# EAGLE schematic MDE-DR-4 (EAGLE 6.4)

## Sheet 1 of 4
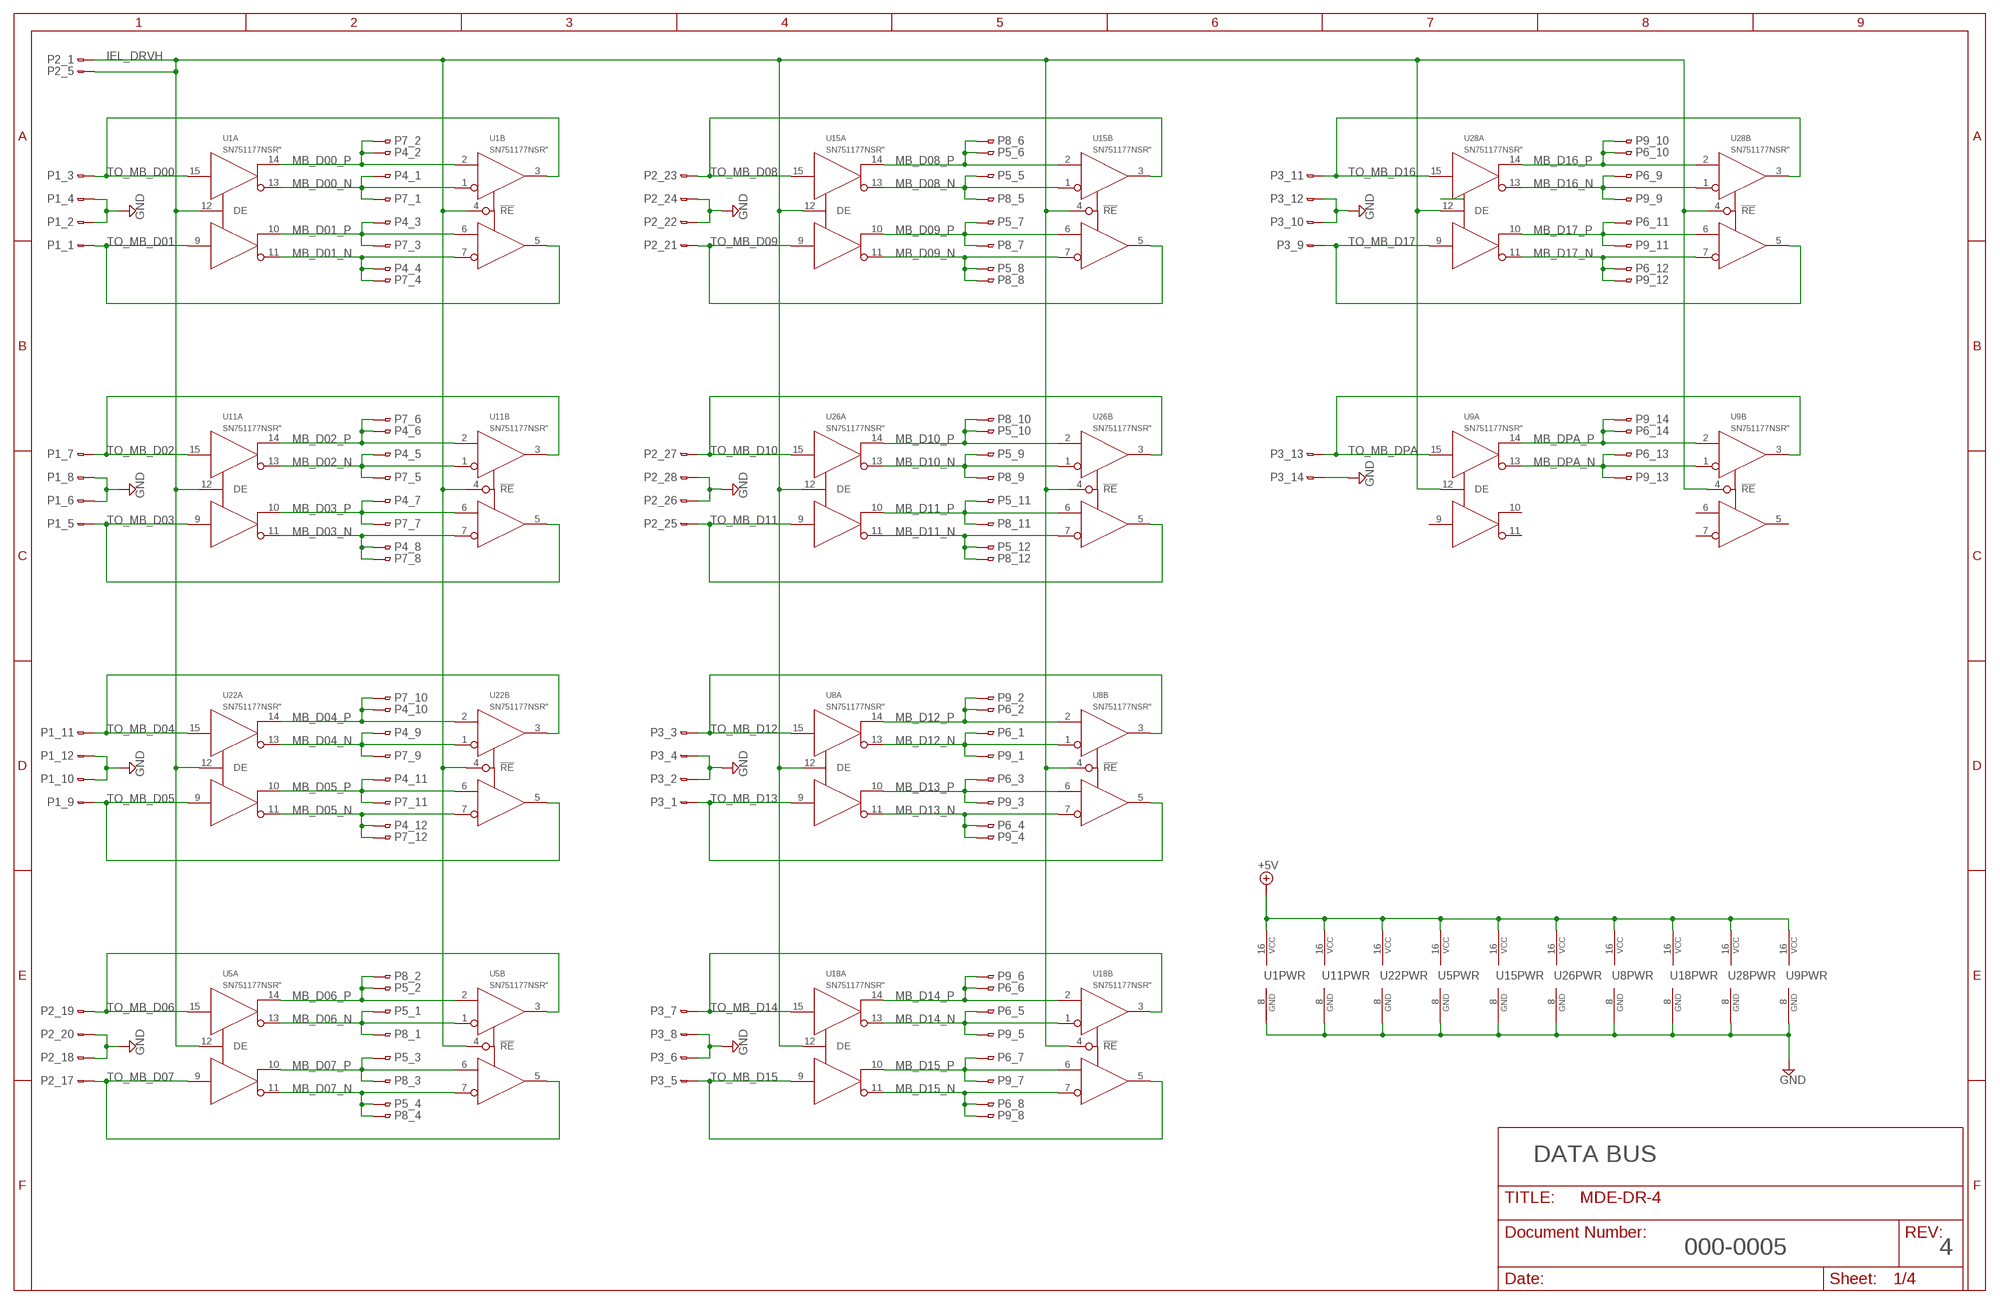
[diagram p0: schematic, sheet 1]

### Parts
P1  CON50L  [CON50L]
P2  CON50L  [CON50L]
P3  CON50L  [CON50L]
P4  CON40L  [CON40L]
P5  CON40L  [CON40L]
P6  CON40L  [CON40L]
P7  CON40L  [CON40L]
P8  CON40L  [CON40L]
P9  CON40L  [CON40L]
U1  SN751177NSR"  [SO16NS]
U5  SN751177NSR"  [SO16NS]
U8  SN751177NSR"  [SO16NS]
U9  SN751177NSR"  [SO16NS]
U11  SN751177NSR"  [SO16NS]
U15  SN751177NSR"  [SO16NS]
U18  SN751177NSR"  [SO16NS]
U22  SN751177NSR"  [SO16NS]
U26  SN751177NSR"  [SO16NS]
U28  SN751177NSR"  [SO16NS]

### Nets
+5V: U1.16(PWR:VCC) U5.16(PWR:VCC) U8.16(PWR:VCC) U9.16(PWR:VCC) U11.16(PWR:VCC) U15.16(PWR:VCC) U18.16(PWR:VCC) U22.16(PWR:VCC) U26.16(PWR:VCC) U28.16(PWR:VCC) ; also sheet 2,3,4
GND: P1.2 P1.4 P1.6 P1.8 P1.10 P1.12 P2.18 P2.20 P2.22 P2.24 P2.26 P2.28 P3.2 P3.4 P3.6 P3.8 P3.10 P3.12 P3.14 U1.8(PWR:GND) U5.8(PWR:GND) U8.8(PWR:GND) U9.8(PWR:GND) U11.8(PWR:GND) U15.8(PWR:GND) U18.8(PWR:GND) U22.8(PWR:GND) U26.8(PWR:GND) U28.8(PWR:GND) ; also sheet 2,3,4
IEL_DRVH: P2.1 P2.5 U1.4(B:!RE) U1.12(A:DE) U5.4(B:!RE) U5.12(A:DE) U8.4(B:!RE) U8.12(A:DE) U9.4(B:!RE) U9.12(A:DE) U11.4(B:!RE) U11.12(A:DE) U15.4(B:!RE) U15.12(A:DE) U18.4(B:!RE) U18.12(A:DE) U22.4(B:!RE) U22.12(A:DE) U26.4(B:!RE) U26.12(A:DE) U28.4(B:!RE) U28.12(A:DE)
MB_D00_N: P4.1 P7.1 U1.1(B:!1B) U1.13(A:!1Z)
MB_D00_P: P4.2 P7.2 U1.2(B:1A) U1.14(A:1Y)
MB_D01_N: P4.4 P7.4 U1.7(B:!2B) U1.11(A:!2Z)
MB_D01_P: P4.3 P7.3 U1.6(B:2A) U1.10(A:2Y)
MB_D02_N: P4.5 P7.5 U11.1(B:!1B) U11.13(A:!1Z)
MB_D02_P: P4.6 P7.6 U11.2(B:1A) U11.14(A:1Y)
MB_D03_N: P4.8 P7.8 U11.7(B:!2B) U11.11(A:!2Z)
MB_D03_P: P4.7 P7.7 U11.6(B:2A) U11.10(A:2Y)
MB_D04_N: P4.9 P7.9 U22.1(B:!1B) U22.13(A:!1Z)
MB_D04_P: P4.10 P7.10 U22.2(B:1A) U22.14(A:1Y)
MB_D05_N: P4.12 P7.12 U22.7(B:!2B) U22.11(A:!2Z)
MB_D05_P: P4.11 P7.11 U22.6(B:2A) U22.10(A:2Y)
MB_D06_N: P5.1 P8.1 U5.1(B:!1B) U5.13(A:!1Z)
MB_D06_P: P5.2 P8.2 U5.2(B:1A) U5.14(A:1Y)
MB_D07_N: P5.4 P8.4 U5.7(B:!2B) U5.11(A:!2Z)
MB_D07_P: P5.3 P8.3 U5.6(B:2A) U5.10(A:2Y)
MB_D08_N: P5.5 P8.5 U15.1(B:!1B) U15.13(A:!1Z)
MB_D08_P: P5.6 P8.6 U15.2(B:1A) U15.14(A:1Y)
MB_D09_N: P5.8 P8.8 U15.7(B:!2B) U15.11(A:!2Z)
MB_D09_P: P5.7 P8.7 U15.6(B:2A) U15.10(A:2Y)
MB_D10_N: P5.9 P8.9 U26.1(B:!1B) U26.13(A:!1Z)
MB_D10_P: P5.10 P8.10 U26.2(B:1A) U26.14(A:1Y)
MB_D11_N: P5.12 P8.12 U26.7(B:!2B) U26.11(A:!2Z)
MB_D11_P: P5.11 P8.11 U26.6(B:2A) U26.10(A:2Y)
MB_D12_N: P6.1 P9.1 U8.1(B:!1B) U8.13(A:!1Z)
MB_D12_P: P6.2 P9.2 U8.2(B:1A) U8.14(A:1Y)
MB_D13_N: P6.4 P9.4 U8.7(B:!2B) U8.11(A:!2Z)
MB_D13_P: P6.3 P9.3 U8.6(B:2A) U8.10(A:2Y)
MB_D14_N: P6.5 P9.5 U18.1(B:!1B) U18.13(A:!1Z)
MB_D14_P: P6.6 P9.6 U18.2(B:1A) U18.14(A:1Y)
MB_D15_N: P6.8 P9.8 U18.7(B:!2B) U18.11(A:!2Z)
MB_D15_P: P6.7 P9.7 U18.6(B:2A) U18.10(A:2Y)
MB_D16_N: P6.9 P9.9 U28.1(B:!1B) U28.13(A:!1Z)
MB_D16_P: P6.10 P9.10 U28.2(B:1A) U28.14(A:1Y)
MB_D17_N: P6.12 P9.12 U28.7(B:!2B) U28.11(A:!2Z)
MB_D17_P: P6.11 P9.11 U28.6(B:2A) U28.10(A:2Y)
MB_DPA_N: P6.13 P9.13 U9.1(B:!1B) U9.13(A:!1Z)
MB_DPA_P: P6.14 P9.14 U9.2(B:1A) U9.14(A:1Y)
TO_MB_D00: P1.3 U1.3(B:1R) U1.15(A:1D)
TO_MB_D01: P1.1 U1.5(B:2R) U1.9(A:2D)
TO_MB_D02: P1.7 U11.3(B:1R) U11.15(A:1D)
TO_MB_D03: P1.5 U11.5(B:2R) U11.9(A:2D)
TO_MB_D04: P1.11 U22.3(B:1R) U22.15(A:1D)
TO_MB_D05: P1.9 U22.5(B:2R) U22.9(A:2D)
TO_MB_D06: P2.19 U5.3(B:1R) U5.15(A:1D)
TO_MB_D07: P2.17 U5.5(B:2R) U5.9(A:2D)
TO_MB_D08: P2.23 U15.3(B:1R) U15.15(A:1D)
TO_MB_D09: P2.21 U15.5(B:2R) U15.9(A:2D)
TO_MB_D10: P2.27 U26.3(B:1R) U26.15(A:1D)
TO_MB_D11: P2.25 U26.5(B:2R) U26.9(A:2D)
TO_MB_D12: P3.3 U8.3(B:1R) U8.15(A:1D)
TO_MB_D13: P3.1 U8.5(B:2R) U8.9(A:2D)
TO_MB_D14: P3.7 U18.3(B:1R) U18.15(A:1D)
TO_MB_D15: P3.5 U18.5(B:2R) U18.9(A:2D)
TO_MB_D16: P3.11 U28.3(B:1R) U28.15(A:1D)
TO_MB_D17: P3.9 U28.5(B:2R) U28.9(A:2D)
TO_MB_DPA: P3.13 U9.3(B:1R) U9.15(A:1D)
Unconnected: P1.49 P2.49 P3.49 U9.5(B:2R) U9.6(B:2A) U9.7(B:!2B) U9.9(A:2D) U9.10(A:2Y) U9.11(A:!2Z)

### Notes on the sheet
- DATA BUS
- 000-0005 | 4

## Sheet 2 of 4
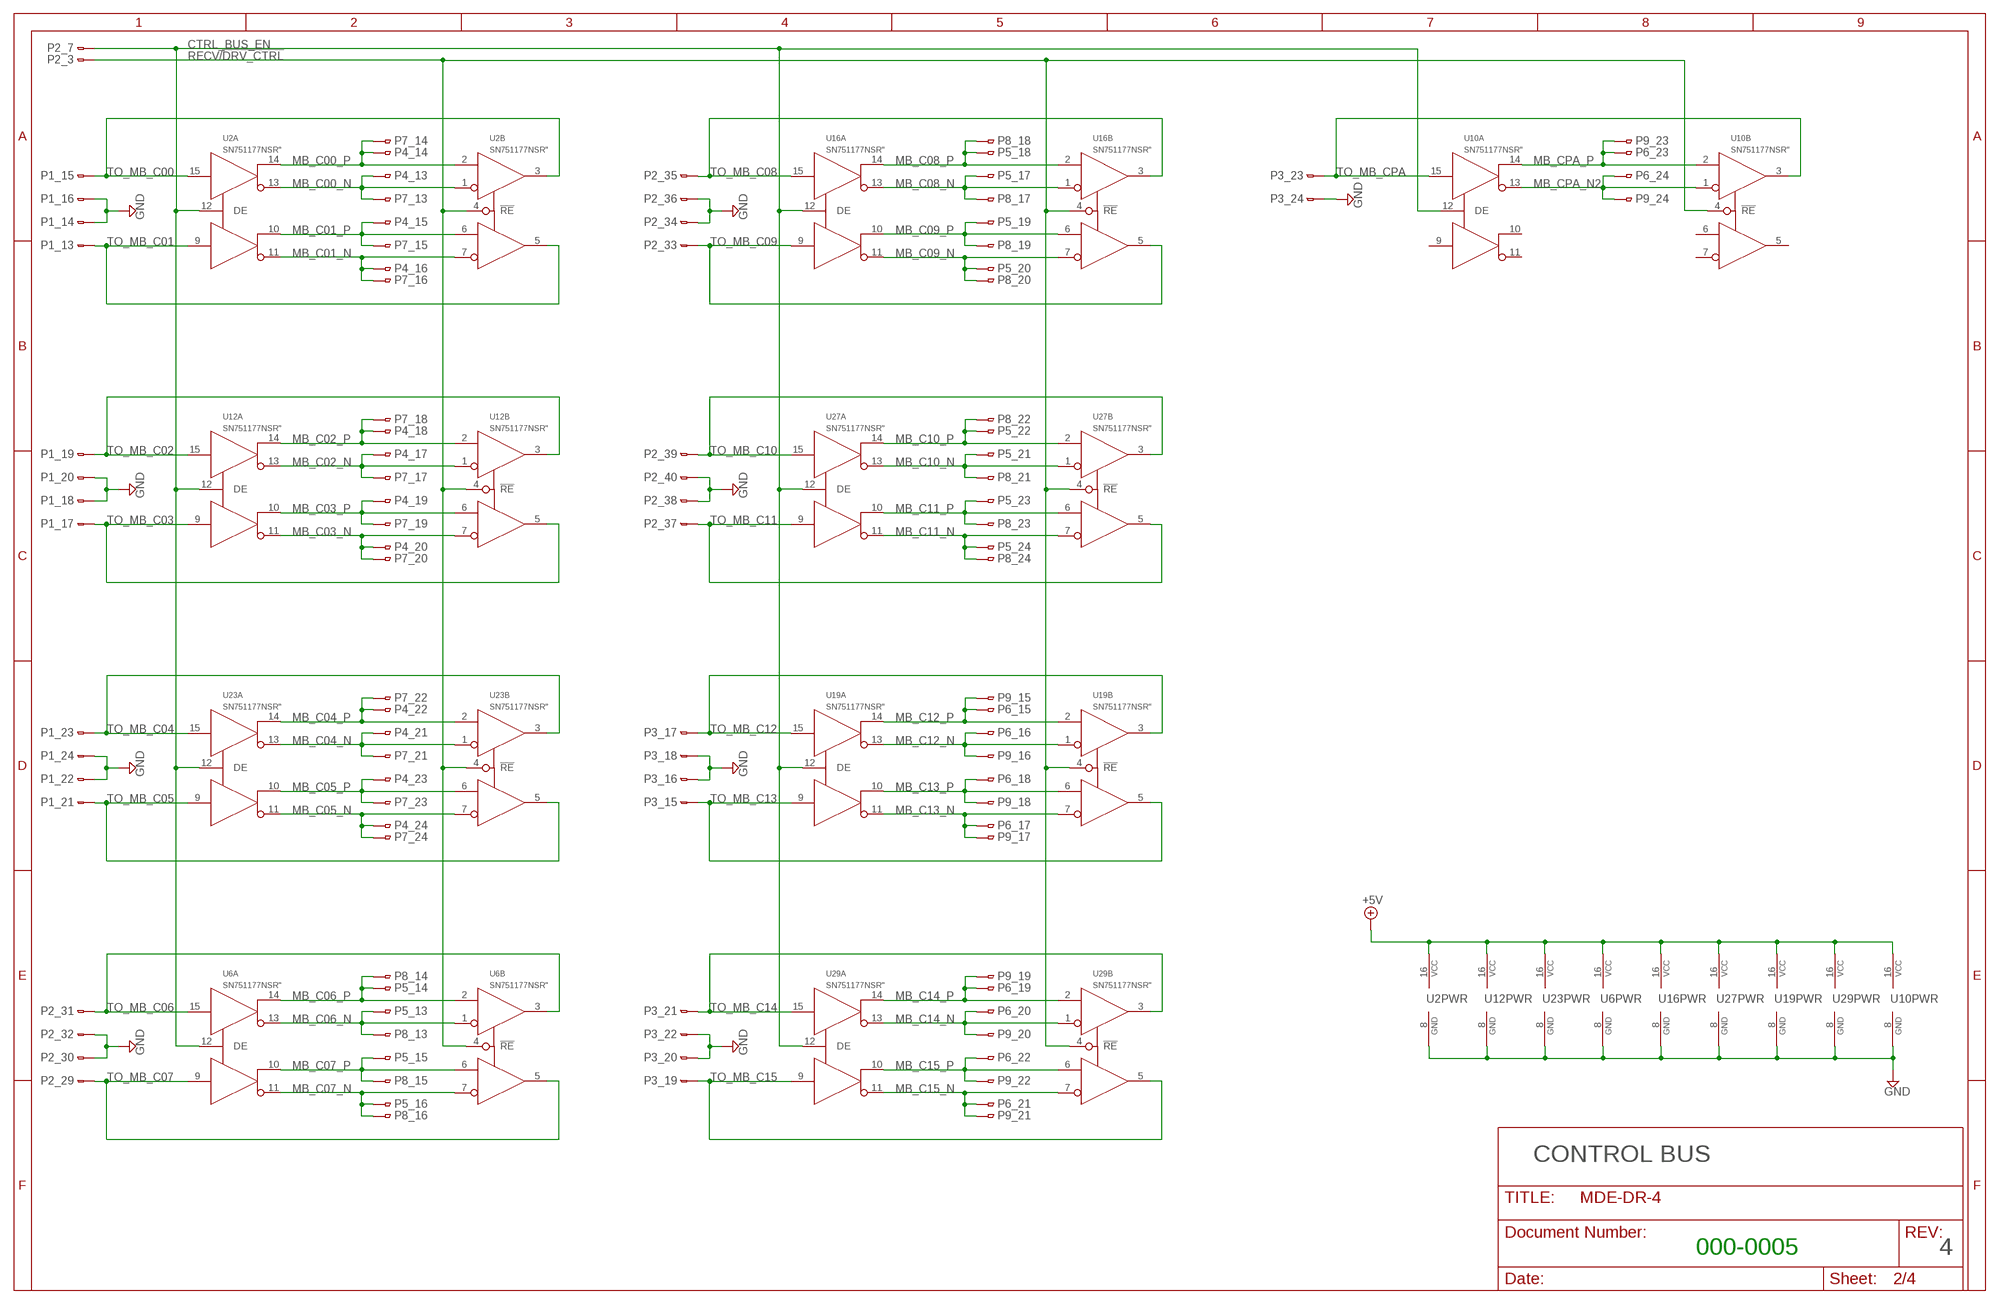
[diagram p1: schematic, sheet 2]

### Parts
U2  SN751177NSR"  [SO16NS]
U6  SN751177NSR"  [SO16NS]
U10  SN751177NSR"  [SO16NS]
U12  SN751177NSR"  [SO16NS]
U16  SN751177NSR"  [SO16NS]
U19  SN751177NSR"  [SO16NS]
U23  SN751177NSR"  [SO16NS]
U27  SN751177NSR"  [SO16NS]
U29  SN751177NSR"  [SO16NS]

### Nets
+5V: U2.16(PWR:VCC) U6.16(PWR:VCC) U10.16(PWR:VCC) U12.16(PWR:VCC) U16.16(PWR:VCC) U19.16(PWR:VCC) U23.16(PWR:VCC) U27.16(PWR:VCC) U29.16(PWR:VCC) ; also sheet 1,3,4
CTRL_BUS_EN: P2.7 U2.12(A:DE) U6.12(A:DE) U10.12(A:DE) U12.12(A:DE) U16.12(A:DE) U19.12(A:DE) U23.12(A:DE) U27.12(A:DE) U29.12(A:DE)
GND: P1.14 P1.16 P1.18 P1.20 P1.22 P1.24 P2.30 P2.32 P2.34 P2.36 P2.38 P2.40 P3.16 P3.18 P3.20 P3.22 P3.24 U2.8(PWR:GND) U6.8(PWR:GND) U10.8(PWR:GND) U12.8(PWR:GND) U16.8(PWR:GND) U19.8(PWR:GND) U23.8(PWR:GND) U27.8(PWR:GND) U29.8(PWR:GND) ; also sheet 1,3,4
MB_C00_N: P4.13 P7.13 U2.1(B:!1B) U2.13(A:!1Z)
MB_C00_P: P4.14 P7.14 U2.2(B:1A) U2.14(A:1Y)
MB_C01_N: P4.16 P7.16 U2.7(B:!2B) U2.11(A:!2Z)
MB_C01_P: P4.15 P7.15 U2.6(B:2A) U2.10(A:2Y)
MB_C02_N: P4.17 P7.17 U12.1(B:!1B) U12.13(A:!1Z)
MB_C02_P: P4.18 P7.18 U12.2(B:1A) U12.14(A:1Y)
MB_C03_N: P4.20 P7.20 U12.7(B:!2B) U12.11(A:!2Z)
MB_C03_P: P4.19 P7.19 U12.6(B:2A) U12.10(A:2Y)
MB_C04_N: P4.21 P7.21 U23.1(B:!1B) U23.13(A:!1Z)
MB_C04_P: P4.22 P7.22 U23.2(B:1A) U23.14(A:1Y)
MB_C05_N: P4.24 P7.24 U23.7(B:!2B) U23.11(A:!2Z)
MB_C05_P: P4.23 P7.23 U23.6(B:2A) U23.10(A:2Y)
MB_C06_N: P5.13 P8.13 U6.1(B:!1B) U6.13(A:!1Z)
MB_C06_P: P5.14 P8.14 U6.2(B:1A) U6.14(A:1Y)
MB_C07_N: P5.16 P8.16 U6.7(B:!2B) U6.11(A:!2Z)
MB_C07_P: P5.15 P8.15 U6.6(B:2A) U6.10(A:2Y)
MB_C08_N: P5.17 P8.17 U16.1(B:!1B) U16.13(A:!1Z)
MB_C08_P: P5.18 P8.18 U16.2(B:1A) U16.14(A:1Y)
MB_C09_N: P5.20 P8.20 U16.7(B:!2B) U16.11(A:!2Z)
MB_C09_P: P5.19 P8.19 U16.6(B:2A) U16.10(A:2Y)
MB_C10_N: P5.21 P8.21 U27.1(B:!1B) U27.13(A:!1Z)
MB_C10_P: P5.22 P8.22 U27.2(B:1A) U27.14(A:1Y)
MB_C11_N: P5.24 P8.24 U27.7(B:!2B) U27.11(A:!2Z)
MB_C11_P: P5.23 P8.23 U27.6(B:2A) U27.10(A:2Y)
MB_C12_N: P6.16 P9.16 U19.1(B:!1B) U19.13(A:!1Z)
MB_C12_P: P6.15 P9.15 U19.2(B:1A) U19.14(A:1Y)
MB_C13_N: P6.17 P9.17 U19.7(B:!2B) U19.11(A:!2Z)
MB_C13_P: P6.18 P9.18 U19.6(B:2A) U19.10(A:2Y)
MB_C14_N: P6.20 P9.20 U29.1(B:!1B) U29.13(A:!1Z)
MB_C14_P: P6.19 P9.19 U29.2(B:1A) U29.14(A:1Y)
MB_C15_N: P6.21 P9.21 U29.7(B:!2B) U29.11(A:!2Z)
MB_C15_P: P6.22 P9.22 U29.6(B:2A) U29.10(A:2Y)
MB_CPA_N2: P6.24 P9.24 U10.1(B:!1B) U10.13(A:!1Z)
MB_CPA_P: P6.23 P9.23 U10.2(B:1A) U10.14(A:1Y)
RECV/!DRV_CTRL: P2.3 U2.4(B:!RE) U6.4(B:!RE) U10.4(B:!RE) U12.4(B:!RE) U16.4(B:!RE) U19.4(B:!RE) U23.4(B:!RE) U27.4(B:!RE) U29.4(B:!RE)
TO_MB_C00: P1.15 U2.3(B:1R) U2.15(A:1D)
TO_MB_C01: P1.13 U2.5(B:2R) U2.9(A:2D)
TO_MB_C02: P1.19 U12.3(B:1R) U12.15(A:1D)
TO_MB_C03: P1.17 U12.5(B:2R) U12.9(A:2D)
TO_MB_C04: P1.23 U23.3(B:1R) U23.15(A:1D)
TO_MB_C05: P1.21 U23.5(B:2R) U23.9(A:2D)
TO_MB_C06: P2.31 U6.3(B:1R) U6.15(A:1D)
TO_MB_C07: P2.29 U6.5(B:2R) U6.9(A:2D)
TO_MB_C08: P2.35 U16.3(B:1R) U16.15(A:1D)
TO_MB_C09: P2.33 U16.5(B:2R) U16.9(A:2D)
TO_MB_C10: P2.39 U27.3(B:1R) U27.15(A:1D)
TO_MB_C11: P2.37 U27.5(B:2R) U27.9(A:2D)
TO_MB_C12: P3.17 U19.3(B:1R) U19.15(A:1D)
TO_MB_C13: P3.15 U19.5(B:2R) U19.9(A:2D)
TO_MB_C14: P3.21 U29.3(B:1R) U29.15(A:1D)
TO_MB_C15: P3.19 U29.5(B:2R) U29.9(A:2D)
TO_MB_CPA: P3.23 U10.3(B:1R) U10.15(A:1D)
Unconnected: U10.5(B:2R) U10.6(B:2A) U10.7(B:!2B) U10.9(A:2D) U10.10(A:2Y) U10.11(A:!2Z)

### Notes on the sheet
- CONTROL BUS
- 000-0005 | 4

## Sheet 3 of 4
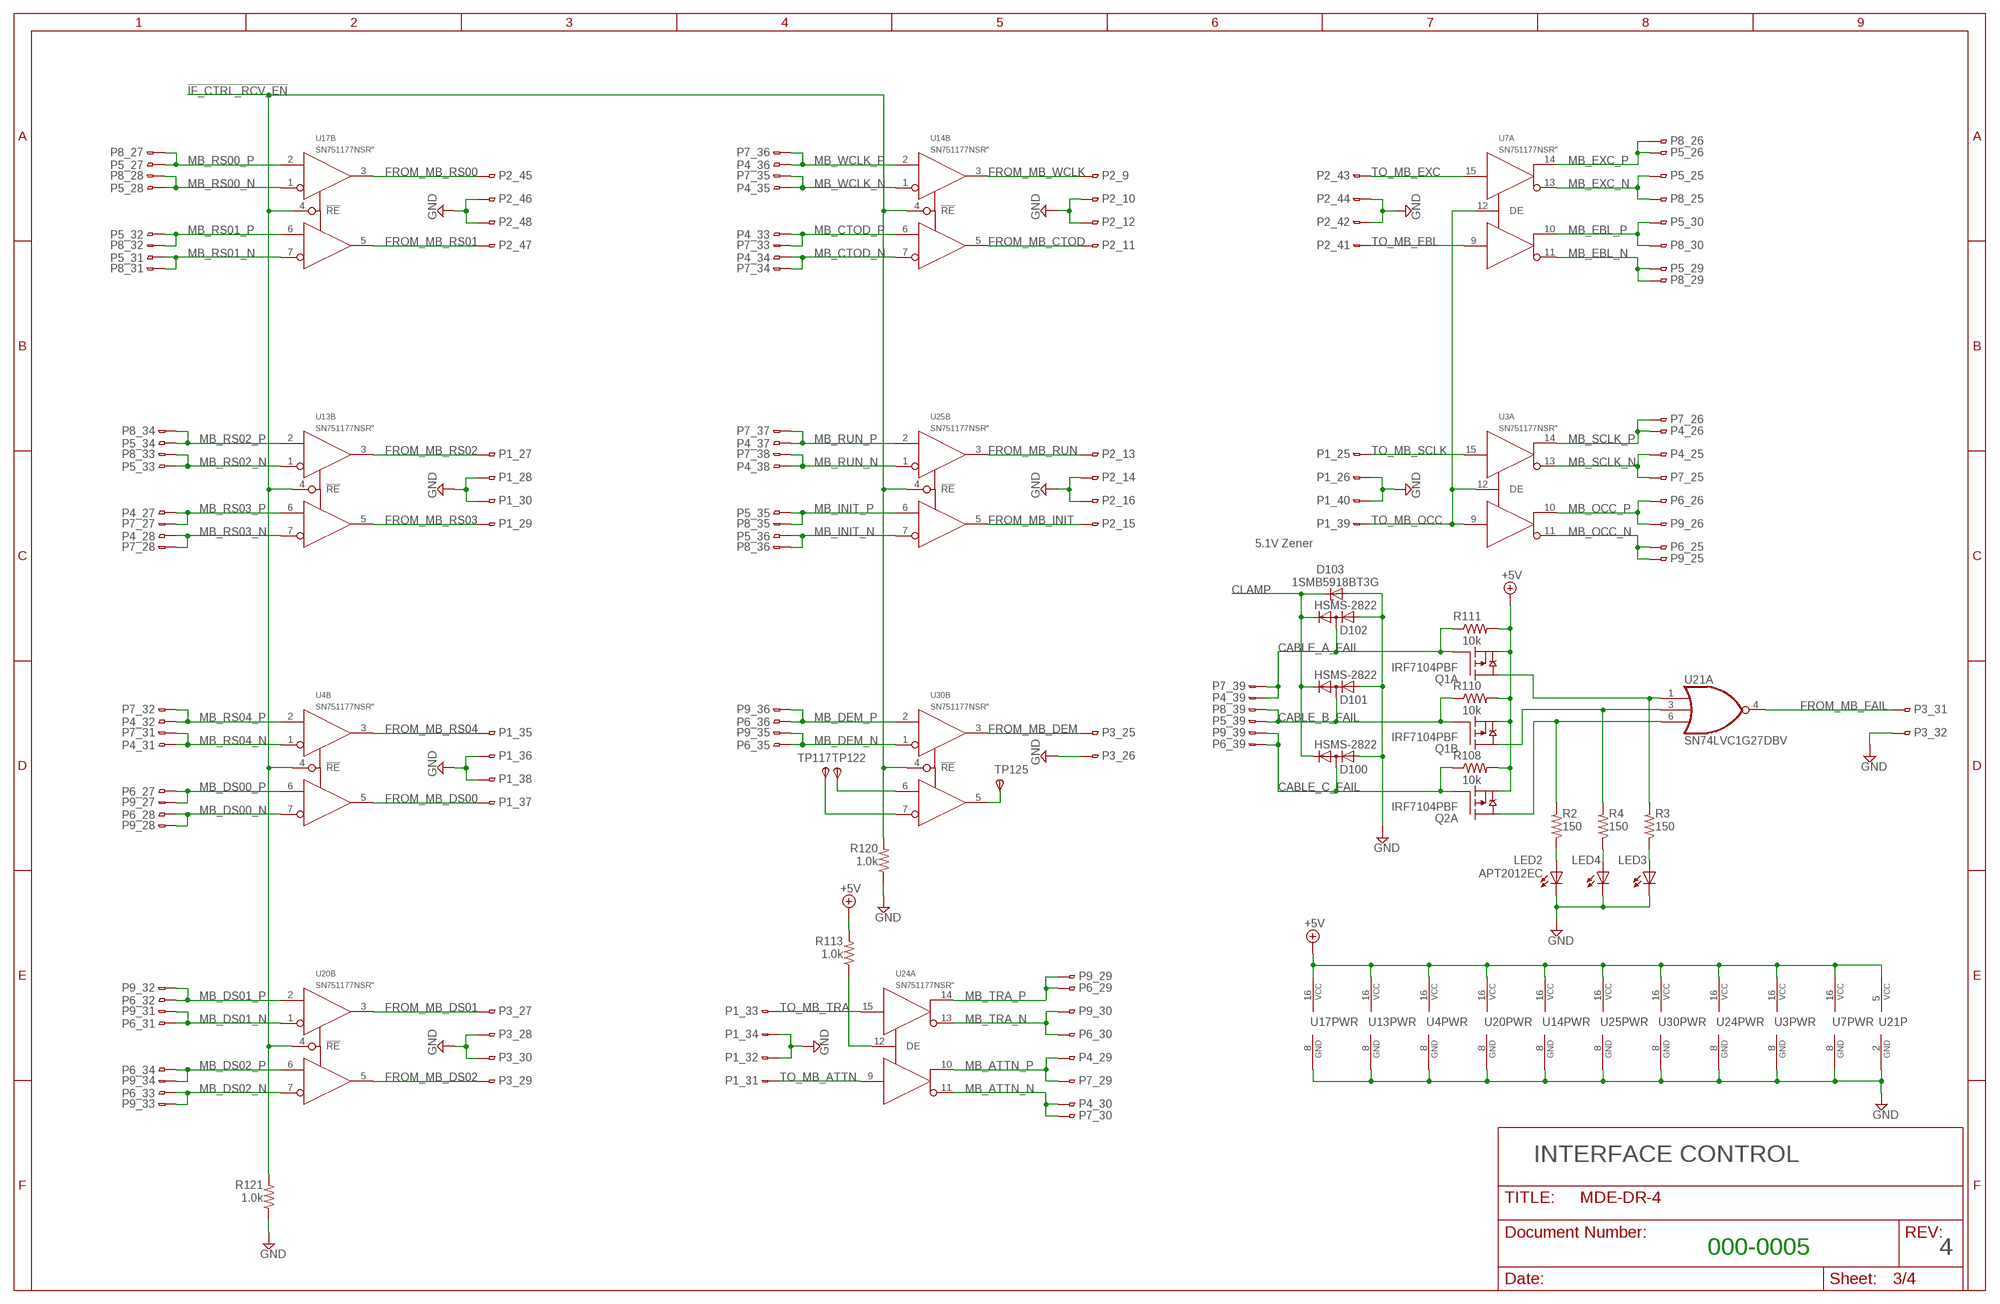
[diagram p2: schematic, sheet 3]

### Parts
D100  HSMS-2822  DIODE_2CACA-SOT23  [SOT23]
D101  HSMS-2822  DIODE_2CACA-SOT23  [SOT23]
D102  HSMS-2822  DIODE_2CACA-SOT23  [SOT23]
D103  1SMB5918BT3G  ZENER-DIODESMB  [SMB]
LED2  APT2012EC  LEDSML0805  [SML0805]
LED3  APT2012EC  LEDSML0805  [SML0805]
LED4  APT2012EC  LEDSML0805  [SML0805]
Q1  IRF7104PBF  [SO-08]
Q2  IRF7104PBF  [SO-08]
R2  150  R-US_R0805  [R0805]
R3  150  R-US_R0805  [R0805]
R4  150  R-US_R0805  [R0805]
R108  10k  R-US_R0805  [R0805]
R110  10k  R-US_R0805  [R0805]
R111  10k  R-US_R0805  [R0805]
R113  1.0k  R-US_R0805  [R0805]
R120  1.0k  R-US_R0805  [R0805]
R121  1.0k  R-US_R0805  [R0805]
TP117  TPSTP12R  [TP12R]
TP122  TPSTP12R  [TP12R]
TP125  TPSTP12R  [TP12R]
U3  SN751177NSR"  [SO16NS]
U4  SN751177NSR"  [SO16NS]
U7  SN751177NSR"  [SO16NS]
U13  SN751177NSR"  [SO16NS]
U14  SN751177NSR"  [SO16NS]
U17  SN751177NSR"  [SO16NS]
U20  SN751177NSR"  [SO16NS]
U21  SN74LVC1G27DBV  [DBV_R-PDSO-G6]
U24  SN751177NSR"  [SO16NS]
U25  SN751177NSR"  [SO16NS]
U30  SN751177NSR"  [SO16NS]

### Nets
!IF_CTRL_RCV_EN: R120.2 R121.2 U4.4(B:!RE) U13.4(B:!RE) U14.4(B:!RE) U17.4(B:!RE) U20.4(B:!RE) U25.4(B:!RE) U30.4(B:!RE)
+5V: Q1.1(A:S) Q1.3(B:S) Q2.1(A:S) R108.2 R110.2 R111.2 R113.2 U3.16(PWR:VCC) U4.16(PWR:VCC) U7.16(PWR:VCC) U13.16(PWR:VCC) U14.16(PWR:VCC) U17.16(PWR:VCC) U20.16(PWR:VCC) U21.5(P:VCC) U24.16(PWR:VCC) U25.16(PWR:VCC) U30.16(PWR:VCC) ; also sheet 1,2,4
CABLE_A_FAIL: D102.3(AC) P4.39 P7.39 Q1.2(A:G) R111.1
CABLE_B_FAIL: D101.3(AC) P5.39 P8.39 Q1.4(B:G) R110.1
CABLE_C_FAIL: D100.3(AC) P6.39 P9.39 Q2.2(A:G) R108.1
CLAMP: D100.2(C) D101.2(C) D102.2(C) D103.C
FROM_MB_CTOD: P2.11 U14.5(B:2R)
FROM_MB_DEM: P3.25 U30.3(B:1R)
FROM_MB_DS00: P1.37 U4.5(B:2R)
FROM_MB_DS01: P3.27 U20.3(B:1R)
FROM_MB_DS02: P3.29 U20.5(B:2R)
FROM_MB_FAIL: P3.31 U21.4(A:Y)
FROM_MB_INIT: P2.15 U25.5(B:2R)
FROM_MB_RS00: P2.45 U17.3(B:1R)
FROM_MB_RS01: P2.47 U17.5(B:2R)
FROM_MB_RS02: P1.27 U13.3(B:1R)
FROM_MB_RS03: P1.29 U13.5(B:2R)
FROM_MB_RS04: P1.35 U4.3(B:1R)
FROM_MB_RUN: P2.13 U25.3(B:1R)
FROM_MB_WCLK: P2.9 U14.3(B:1R)
GND: D100.1(A) D101.1(A) D102.1(A) D103.A LED2.C LED3.C LED4.C P1.26 P1.28 P1.30 P1.32 P1.34 P1.36 P1.38 P1.40 P2.10 P2.12 P2.14 P2.16 P2.42 P2.44 P2.46 P2.48 P3.26 P3.28 P3.30 P3.32 R120.1 R121.1 U3.8(PWR:GND) U4.8(PWR:GND) U7.8(PWR:GND) U13.8(PWR:GND) U14.8(PWR:GND) U17.8(PWR:GND) U20.8(PWR:GND) U21.2(P:GND) U24.8(PWR:GND) U25.8(PWR:GND) U30.8(PWR:GND) ; also sheet 1,2,4
MB_ATTN_N: P4.30 P7.30 U24.11(A:!2Z)
MB_ATTN_P: P4.29 P7.29 U24.10(A:2Y)
MB_CTOD_N: P4.34 P7.34 U14.7(B:!2B)
MB_CTOD_P: P4.33 P7.33 U14.6(B:2A)
MB_DEM_N: P6.35 P9.35 U30.1(B:!1B)
MB_DEM_P: P6.36 P9.36 U30.2(B:1A)
MB_DS00_N: P6.28 P9.28 U4.7(B:!2B)
MB_DS00_P: P6.27 P9.27 U4.6(B:2A)
MB_DS01_N: P6.31 P9.31 U20.1(B:!1B)
MB_DS01_P: P6.32 P9.32 U20.2(B:1A)
MB_DS02_N: P6.33 P9.33 U20.7(B:!2B)
MB_DS02_P: P6.34 P9.34 U20.6(B:2A)
MB_EBL_N: P5.29 P8.29 U7.11(A:!2Z)
MB_EBL_P: P5.30 P8.30 U7.10(A:2Y)
MB_EXC_N: P5.25 P8.25 U7.13(A:!1Z)
MB_EXC_P: P5.26 P8.26 U7.14(A:1Y)
MB_INIT_N: P5.36 P8.36 U25.7(B:!2B)
MB_INIT_P: P5.35 P8.35 U25.6(B:2A)
MB_OCC_N: P6.25 P9.25 U3.11(A:!2Z)
MB_OCC_P: P6.26 P9.26 U3.10(A:2Y)
MB_RS00_N: P5.28 P8.28 U17.1(B:!1B)
MB_RS00_P: P5.27 P8.27 U17.2(B:1A)
MB_RS01_N: P5.31 P8.31 U17.7(B:!2B)
MB_RS01_P: P5.32 P8.32 U17.6(B:2A)
MB_RS02_N: P5.33 P8.33 U13.1(B:!1B)
MB_RS02_P: P5.34 P8.34 U13.2(B:1A)
MB_RS03_N: P4.28 P7.28 U13.7(B:!2B)
MB_RS03_P: P4.27 P7.27 U13.6(B:2A)
MB_RS04_N: P4.31 P7.31 U4.1(B:!1B)
MB_RS04_P: P4.32 P7.32 U4.2(B:1A)
MB_RUN_N: P4.38 P7.38 U25.1(B:!1B)
MB_RUN_P: P4.37 P7.37 U25.2(B:1A)
MB_SCLK_N: P4.25 P7.25 U3.13(A:!1Z)
MB_SCLK_P: P4.26 P7.26 U3.14(A:1Y)
MB_TRA_N: P6.30 P9.30 U24.13(A:!1Z)
MB_TRA_P: P6.29 P9.29 U24.14(A:1Y)
MB_WCLK_N: P4.35 P7.35 U14.1(B:!1B)
MB_WCLK_P: P4.36 P7.36 U14.2(B:1A)
N$9: R113.1 U24.12(A:DE)
N$51: TP117.TP(PP) U30.7(B:!2B)
N$59: LED2.A R2.1
N$60: Q2.7(A:D) Q2.8(A:D) R2.2 U21.6(A:C)
N$61: Q1.5(B:D) Q1.6(B:D) R4.2 U21.3(A:B)
N$62: Q1.7(A:D) Q1.8(A:D) R3.2 U21.1(A:A)
N$63: LED4.A R4.1
N$64: LED3.A R3.1
N$65: TP125.TP(PP) U30.5(B:2R)
N$87: TP122.TP(PP) U30.6(B:2A)
TO_MB_ATTN: P1.31 U24.9(A:2D)
TO_MB_EBL: P2.41 U7.9(A:2D)
TO_MB_EXC: P2.43 U7.15(A:1D)
TO_MB_OCC: P1.39 U3.9(A:2D) U3.12(A:DE) U7.12(A:DE)
TO_MB_SCLK: P1.25 U3.15(A:1D)
TO_MB_TRA: P1.33 U24.15(A:1D)

### Notes on the sheet
- 5.1V Zener
- INTERFACE CONTROL
- 000-0005 | 4

## Sheet 4 of 4
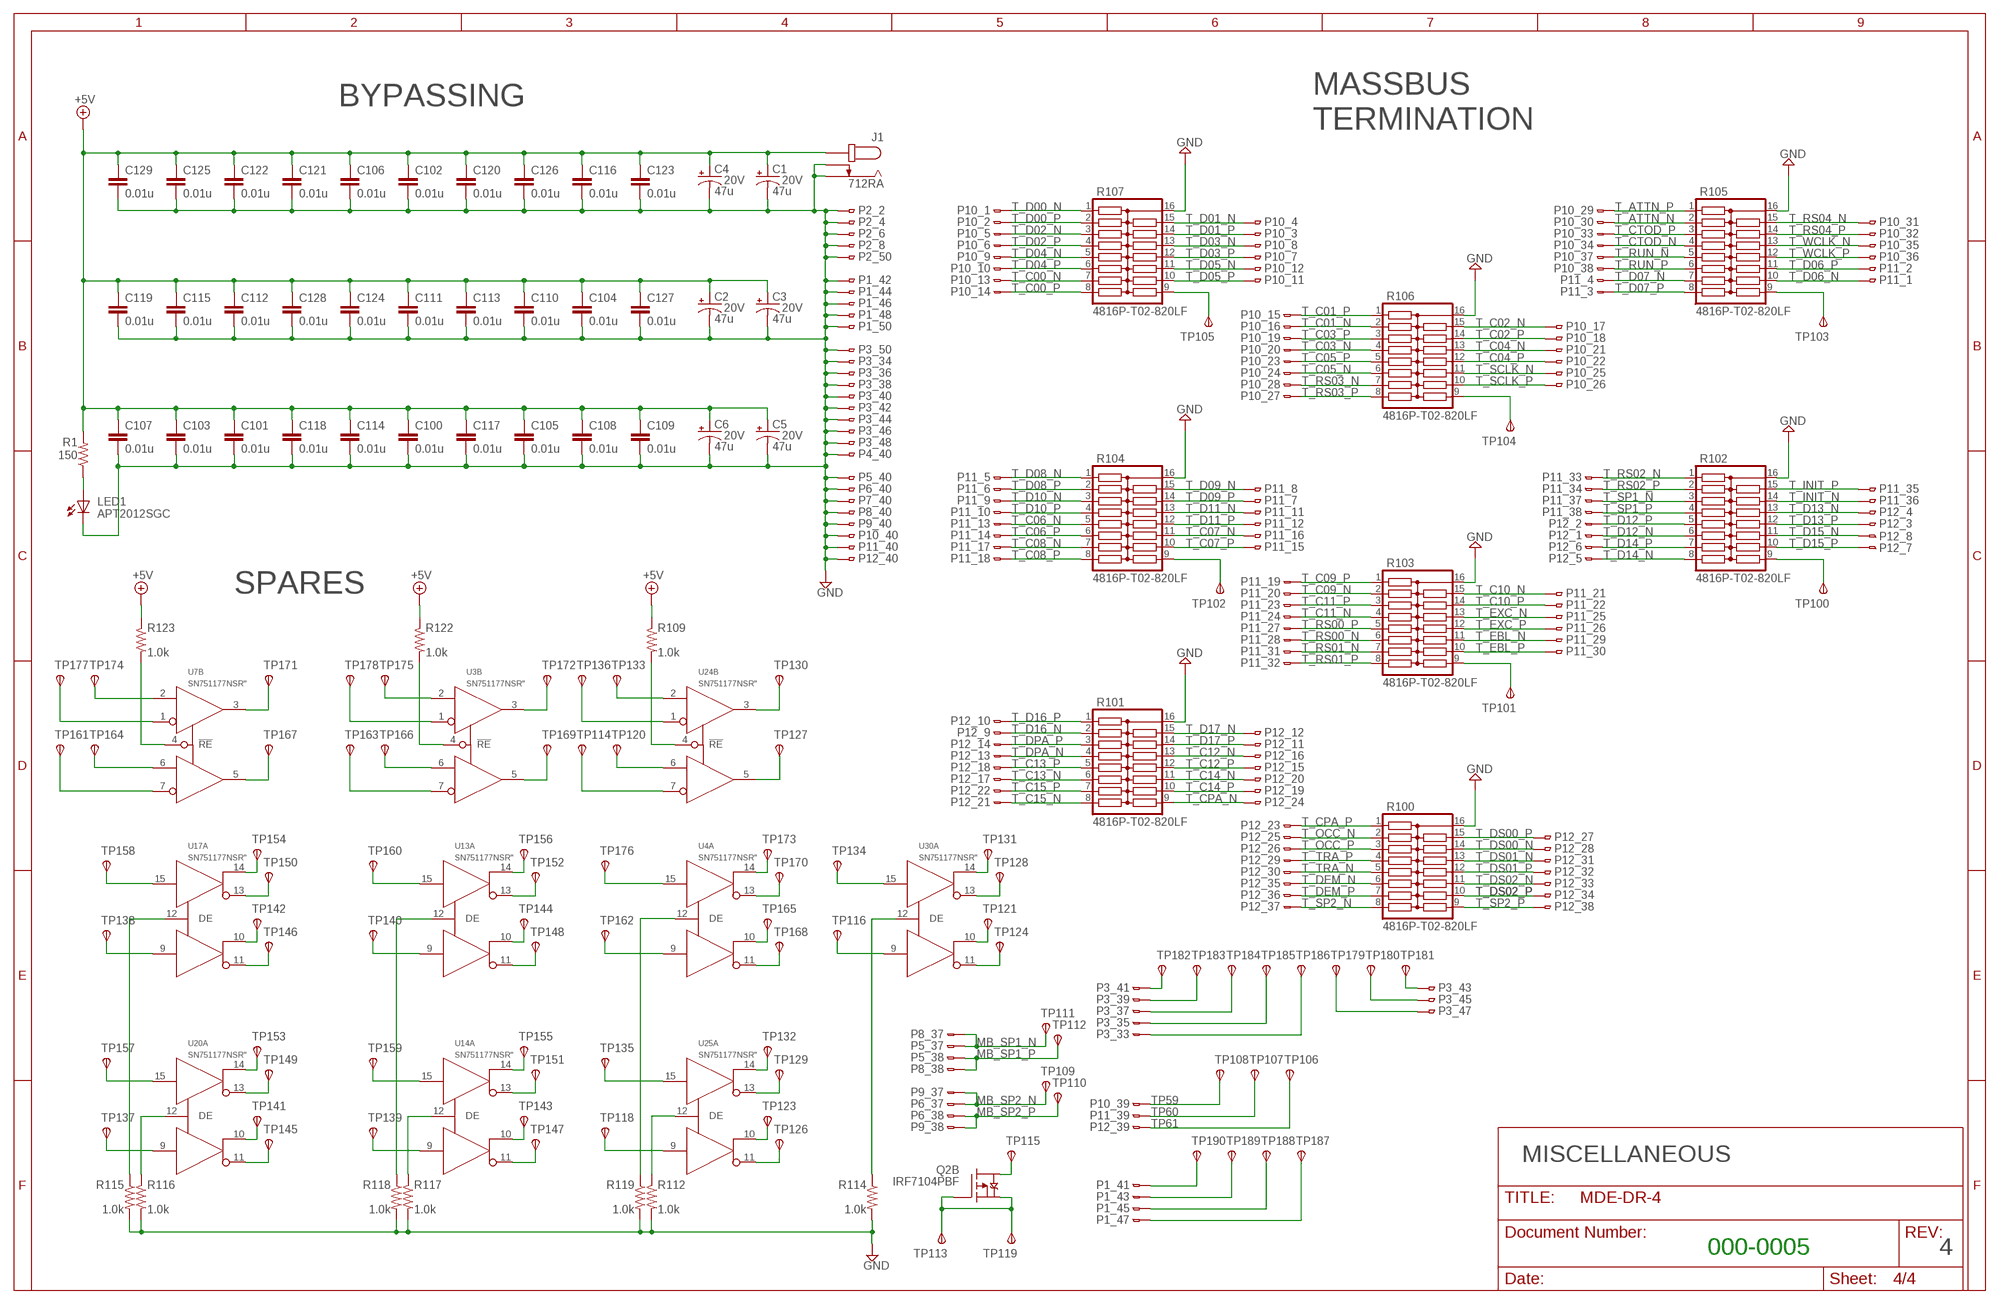
[diagram p3: schematic, sheet 4]

### Parts
C1  47u  CPOL-USC/6032-28R  [C/6032-28R]
C2  47u  CPOL-USC/6032-28R  [C/6032-28R]
C3  47u  CPOL-USC/6032-28R  [C/6032-28R]
C4  47u  CPOL-USC/6032-28R  [C/6032-28R]
C5  47u  CPOL-USC/6032-28R  [C/6032-28R]
C6  47u  CPOL-USC/6032-28R  [C/6032-28R]
C100  0.01u  C-EUC0805K  [C0805K]
C101  0.01u  C-EUC0805K  [C0805K]
C102  0.01u  C-EUC0805K  [C0805K]
C103  0.01u  C-EUC0805K  [C0805K]
C104  0.01u  C-EUC0805K  [C0805K]
C105  0.01u  C-EUC0805K  [C0805K]
C106  0.01u  C-EUC0805K  [C0805K]
C107  0.01u  C-EUC0805K  [C0805K]
C108  0.01u  C-EUC0805K  [C0805K]
C109  0.01u  C-EUC0805K  [C0805K]
C110  0.01u  C-EUC0805K  [C0805K]
C111  0.01u  C-EUC0805K  [C0805K]
C112  0.01u  C-EUC0805K  [C0805K]
C113  0.01u  C-EUC0805K  [C0805K]
C114  0.01u  C-EUC0805K  [C0805K]
C115  0.01u  C-EUC0805K  [C0805K]
C116  0.01u  C-EUC0805K  [C0805K]
C117  0.01u  C-EUC0805K  [C0805K]
C118  0.01u  C-EUC0805K  [C0805K]
C119  0.01u  C-EUC0805K  [C0805K]
C120  0.01u  C-EUC0805K  [C0805K]
C121  0.01u  C-EUC0805K  [C0805K]
C122  0.01u  C-EUC0805K  [C0805K]
C123  0.01u  C-EUC0805K  [C0805K]
C124  0.01u  C-EUC0805K  [C0805K]
C125  0.01u  C-EUC0805K  [C0805K]
C126  0.01u  C-EUC0805K  [C0805K]
C127  0.01u  C-EUC0805K  [C0805K]
C128  0.01u  C-EUC0805K  [C0805K]
C129  0.01u  C-EUC0805K  [C0805K]
J1  712RA  JACK-PLUG1  [712RA]
LED1  APT2012SGC  LEDSML0805  [SML0805]
P10  CON40L  [CON40L]
P11  CON40L  [CON40L]
P12  CON40L  [CON40L]
R1  150  R-US_R0805  [R0805]
R100  4816P-T02-820LF  4816P-T02  [4816P]
R101  4816P-T02-820LF  4816P-T02  [4816P]
R102  4816P-T02-820LF  4816P-T02  [4816P]
R103  4816P-T02-820LF  4816P-T02  [4816P]
R104  4816P-T02-820LF  4816P-T02  [4816P]
R105  4816P-T02-820LF  4816P-T02  [4816P]
R106  4816P-T02-820LF  4816P-T02  [4816P]
R107  4816P-T02-820LF  4816P-T02  [4816P]
R109  1.0k  R-US_R0805  [R0805]
R112  1.0k  R-US_R0805  [R0805]
R114  1.0k  R-US_R0805  [R0805]
R115  1.0k  R-US_R0805  [R0805]
R116  1.0k  R-US_R0805  [R0805]
R117  1.0k  R-US_R0805  [R0805]
R118  1.0k  R-US_R0805  [R0805]
R119  1.0k  R-US_R0805  [R0805]
R122  1.0k  R-US_R0805  [R0805]
R123  1.0k  R-US_R0805  [R0805]
TP100  TPSTP12R  [TP12R]
TP101  TPSTP12R  [TP12R]
TP102  TPSTP12R  [TP12R]
TP103  TPSTP12R  [TP12R]
TP104  TPSTP12R  [TP12R]
TP105  TPSTP12R  [TP12R]
TP106  TPSTP12R  [TP12R]
TP107  TPSTP12R  [TP12R]
TP108  TPSTP12R  [TP12R]
TP109  TPSTP12R  [TP12R]
TP110  TPSTP12R  [TP12R]
TP111  TPSTP12R  [TP12R]
TP112  TPSTP12R  [TP12R]
TP113  TPSTP12R  [TP12R]
TP114  TPSTP12R  [TP12R]
TP115  TPSTP12R  [TP12R]
TP116  TPSTP12R  [TP12R]
TP118  TPSTP12R  [TP12R]
TP119  TPSTP12R  [TP12R]
TP120  TPSTP12R  [TP12R]
TP121  TPSTP12R  [TP12R]
TP123  TPSTP12R  [TP12R]
TP124  TPSTP12R  [TP12R]
TP126  TPSTP12R  [TP12R]
TP127  TPSTP12R  [TP12R]
TP128  TPSTP12R  [TP12R]
TP129  TPSTP12R  [TP12R]
TP130  TPSTP12R  [TP12R]
TP131  TPSTP12R  [TP12R]
TP132  TPSTP12R  [TP12R]
TP133  TPSTP12R  [TP12R]
TP134  TPSTP12R  [TP12R]
TP135  TPSTP12R  [TP12R]
TP136  TPSTP12R  [TP12R]
TP137  TPSTP12R  [TP12R]
TP138  TPSTP12R  [TP12R]
TP139  TPSTP12R  [TP12R]
TP140  TPSTP12R  [TP12R]
TP141  TPSTP12R  [TP12R]
TP142  TPSTP12R  [TP12R]
TP143  TPSTP12R  [TP12R]
TP144  TPSTP12R  [TP12R]
TP145  TPSTP12R  [TP12R]
TP146  TPSTP12R  [TP12R]
TP147  TPSTP12R  [TP12R]
TP148  TPSTP12R  [TP12R]
TP149  TPSTP12R  [TP12R]
TP150  TPSTP12R  [TP12R]
TP151  TPSTP12R  [TP12R]
TP152  TPSTP12R  [TP12R]
TP153  TPSTP12R  [TP12R]
TP154  TPSTP12R  [TP12R]
TP155  TPSTP12R  [TP12R]
TP156  TPSTP12R  [TP12R]
TP157  TPSTP12R  [TP12R]
TP158  TPSTP12R  [TP12R]
TP159  TPSTP12R  [TP12R]
TP160  TPSTP12R  [TP12R]
TP161  TPSTP12R  [TP12R]
TP162  TPSTP12R  [TP12R]
TP163  TPSTP12R  [TP12R]
TP164  TPSTP12R  [TP12R]
TP165  TPSTP12R  [TP12R]
TP166  TPSTP12R  [TP12R]
TP167  TPSTP12R  [TP12R]
TP168  TPSTP12R  [TP12R]
TP169  TPSTP12R  [TP12R]
TP170  TPSTP12R  [TP12R]
TP171  TPSTP12R  [TP12R]
TP172  TPSTP12R  [TP12R]
TP173  TPSTP12R  [TP12R]
TP174  TPSTP12R  [TP12R]
TP175  TPSTP12R  [TP12R]
TP176  TPSTP12R  [TP12R]
TP177  TPSTP12R  [TP12R]
TP178  TPSTP12R  [TP12R]
TP179  TPSTP12R  [TP12R]
TP180  TPSTP12R  [TP12R]
TP181  TPSTP12R  [TP12R]
TP182  TPSTP12R  [TP12R]
TP183  TPSTP12R  [TP12R]
TP184  TPSTP12R  [TP12R]
TP185  TPSTP12R  [TP12R]
TP186  TPSTP12R  [TP12R]
TP187  TPSTP12R  [TP12R]
TP188  TPSTP12R  [TP12R]
TP189  TPSTP12R  [TP12R]
TP190  TPSTP12R  [TP12R]

### Nets
+5V: C1.+ C2.+ C3.+ C4.+ C5.+ C6.+ C100.1 C101.1 C102.1 C103.1 C104.1 C105.1 C106.1 C107.1 C108.1 C109.1 C110.1 C111.1 C112.1 C113.1 C114.1 C115.1 C116.1 C117.1 C118.1 C119.1 C120.1 C121.1 C122.1 C123.1 C124.1 C125.1 C126.1 C127.1 C128.1 C129.1 J1.PIN R1.2 R109.1 R122.1 R123.1 ; also sheet 1,2,3
GND: C1.- C2.- C3.- C4.- C5.- C6.- C100.2 C101.2 C102.2 C103.2 C104.2 C105.2 C106.2 C107.2 C108.2 C109.2 C110.2 C111.2 C112.2 C113.2 C114.2 C115.2 C116.2 C117.2 C118.2 C119.2 C120.2 C121.2 C122.2 C123.2 C124.2 C125.2 C126.2 C127.2 C128.2 C129.2 J1.SLEEVE J1.SLEEVE_SHUNT LED1.C P1.42 P1.44 P1.46 P1.48 P1.50 P2.2 P2.4 P2.6 P2.8 P2.50 P3.34 P3.36 P3.38 P3.40 P3.42 P3.44 P3.46 P3.48 P3.50 P4.40 P5.40 P6.40 P7.40 P8.40 P9.40 P10.40 P11.40 P12.40 R100.16 R101.16 R102.16 R103.16 R104.16 R105.16 R106.16 R107.16 R112.2 R114.2 R115.2 R116.2 R117.2 R118.2 R119.2 ; also sheet 1,2,3
MB_SP1_N: P5.37 P8.37 TP111.TP(PP)
MB_SP1_P: P5.38 P8.38 TP112.TP(PP)
MB_SP2_N: P6.37 P9.37 TP109.TP(PP)
MB_SP2_P: P6.38 P9.38 TP110.TP(PP)
N$1: R119.1 U4.12(A:DE)
N$2: R112.1 U25.12(A:DE)
N$3: TP173.TP(PP) U4.14(A:1Y)
N$4: TP138.TP(PP) U17.9(A:2D)
N$5: TP158.TP(PP) U17.15(A:1D)
N$6: TP157.TP(PP) U20.15(A:1D)
N$7: TP137.TP(PP) U20.9(A:2D)
N$8: TP160.TP(PP) U13.15(A:1D)
N$10: TP140.TP(PP) U13.9(A:2D)
N$11: TP176.TP(PP) U4.15(A:1D)
N$12: TP162.TP(PP) U4.9(A:2D)
N$13: TP135.TP(PP) U25.15(A:1D)
N$14: TP118.TP(PP) U25.9(A:2D)
N$15: TP139.TP(PP) U14.9(A:2D)
N$16: TP159.TP(PP) U14.15(A:1D)
N$17: TP154.TP(PP) U17.14(A:1Y)
N$18: TP150.TP(PP) U17.13(A:!1Z)
N$19: TP142.TP(PP) U17.10(A:2Y)
N$20: TP146.TP(PP) U17.11(A:!2Z)
N$21: TP156.TP(PP) U13.14(A:1Y)
N$22: TP152.TP(PP) U13.13(A:!1Z)
N$23: TP144.TP(PP) U13.10(A:2Y)
N$24: TP148.TP(PP) U13.11(A:!2Z)
N$25: TP155.TP(PP) U14.14(A:1Y)
N$26: TP151.TP(PP) U14.13(A:!1Z)
N$27: TP143.TP(PP) U14.10(A:2Y)
N$28: TP147.TP(PP) U14.11(A:!2Z)
N$29: TP132.TP(PP) U25.14(A:1Y)
N$30: TP129.TP(PP) U25.13(A:!1Z)
N$31: TP123.TP(PP) U25.10(A:2Y)
N$32: TP126.TP(PP) U25.11(A:!2Z)
N$33: TP165.TP(PP) U4.10(A:2Y)
N$34: TP168.TP(PP) U4.11(A:!2Z)
N$35: R117.1 U14.12(A:DE)
N$36: TP170.TP(PP) U4.13(A:!1Z)
N$37: TP153.TP(PP) U20.14(A:1Y)
N$38: TP149.TP(PP) U20.13(A:!1Z)
N$39: TP141.TP(PP) U20.10(A:2Y)
N$40: TP145.TP(PP) U20.11(A:!2Z)
N$41: R118.1 U13.12(A:DE)
N$42: R116.1 U20.12(A:DE)
N$43: R115.1 U17.12(A:DE)
N$44: R114.1 U30.12(A:DE)
N$45: TP116.TP(PP) U30.9(A:2D)
N$46: TP134.TP(PP) U30.15(A:1D)
N$47: TP128.TP(PP) U30.13(A:!1Z)
N$48: TP131.TP(PP) U30.14(A:1Y)
N$49: TP121.TP(PP) U30.10(A:2Y)
N$50: TP124.TP(PP) U30.11(A:!2Z)
N$52: R107.9 TP105.TP(PP)
N$53: R104.9 TP102.TP(PP)
N$54: R106.9 TP104.TP(PP)
N$55: R103.9 TP101.TP(PP)
N$66: R105.9 TP103.TP(PP)
N$67: Q2.3(B:S) Q2.4(B:G) TP113.TP(PP) TP119.TP(PP)
N$68: Q2.5(B:D) Q2.6(B:D) TP115.TP(PP)
N$69: TP174.TP(PP) U7.2(B:1A)
N$70: R102.9 TP100.TP(PP)
N$74: TP177.TP(PP) U7.1(B:!1B)
N$75: TP171.TP(PP) U7.3(B:1R)
N$76: TP178.TP(PP) U3.1(B:!1B)
N$77: TP175.TP(PP) U3.2(B:1A)
N$78: TP172.TP(PP) U3.3(B:1R)
N$79: TP164.TP(PP) U7.6(B:2A)
N$80: TP161.TP(PP) U7.7(B:!2B)
N$81: TP167.TP(PP) U7.5(B:2R)
N$82: TP166.TP(PP) U3.6(B:2A)
N$83: TP163.TP(PP) U3.7(B:!2B)
N$84: TP169.TP(PP) U3.5(B:2R)
N$85: R123.2 U7.4(B:!RE)
N$86: R122.2 U3.4(B:!RE)
N$88: TP133.TP(PP) U24.2(B:1A)
N$89: TP136.TP(PP) U24.1(B:!1B)
N$90: TP120.TP(PP) U24.6(B:2A)
N$91: TP114.TP(PP) U24.7(B:!2B)
N$92: TP130.TP(PP) U24.3(B:1R)
N$93: TP127.TP(PP) U24.5(B:2R)
N$94: R109.2 U24.4(B:!RE)
N$96: P1.41 TP190.TP(PP)
N$97: P1.43 TP189.TP(PP)
N$98: P1.45 TP188.TP(PP)
N$99: P1.47 TP187.TP(PP)
N$101: P3.41 TP182.TP(PP)
N$102: P3.39 TP183.TP(PP)
N$103: P3.37 TP184.TP(PP)
N$104: P3.35 TP185.TP(PP)
N$105: P3.33 TP186.TP(PP)
N$108: P3.47 TP179.TP(PP)
N$109: P3.45 TP180.TP(PP)
N$110: P3.43 TP181.TP(PP)
N$111: LED1.A R1.1
T_ATTN_N: P10.30 R105.2
T_ATTN_P: P10.29 R105.1
T_C00_N: P10.13 R107.7
T_C00_P: P10.14 R107.8
T_C01_N: P10.16 R106.2
T_C01_P: P10.15 R106.1
T_C02_N: P10.17 R106.15
T_C02_P: P10.18 R106.14
T_C03_N: P10.20 R106.4
T_C03_P: P10.19 R106.3
T_C04_N: P10.21 R106.13
T_C04_P: P10.22 R106.12
T_C05_N: P10.24 R106.6
T_C05_P: P10.23 R106.5
T_C06_N: P11.13 R104.5
T_C06_P: P11.14 R104.6
T_C07_N: P11.16 R104.11
T_C07_P: P11.15 R104.10
T_C08_N: P11.17 R104.7
T_C08_P: P11.18 R104.8
T_C09_N: P11.20 R103.2
T_C09_P: P11.19 R103.1
T_C10_N: P11.21 R103.15
T_C10_P: P11.22 R103.14
T_C11_N: P11.24 R103.4
T_C11_P: P11.23 R103.3
T_C12_N: P12.16 R101.13
T_C12_P: P12.15 R101.12
T_C13_N: P12.17 R101.6
T_C13_P: P12.18 R101.5
T_C14_N: P12.20 R101.11
T_C14_P: P12.19 R101.10
T_C15_N: P12.21 R101.8
T_C15_P: P12.22 R101.7
T_CPA_N: P12.24 R101.9
T_CPA_P: P12.23 R100.1
T_CTOD_N: P10.34 R105.4
T_CTOD_P: P10.33 R105.3
T_D00_N: P10.1 R107.1
T_D00_P: P10.2 R107.2
T_D01_N: P10.4 R107.15
T_D01_P: P10.3 R107.14
T_D02_N: P10.5 R107.3
T_D02_P: P10.6 R107.4
T_D03_N: P10.8 R107.13
T_D03_P: P10.7 R107.12
T_D04_N: P10.9 R107.5
T_D04_P: P10.10 R107.6
T_D05_N: P10.12 R107.11
T_D05_P: P10.11 R107.10
T_D06_N: P11.1 R105.10
T_D06_P: P11.2 R105.11
T_D07_N: P11.4 R105.7
T_D07_P: P11.3 R105.8
T_D08_N: P11.5 R104.1
T_D08_P: P11.6 R104.2
T_D09_N: P11.8 R104.15
T_D09_P: P11.7 R104.14
T_D10_N: P11.9 R104.3
T_D10_P: P11.10 R104.4
T_D11_N: P11.11 R104.13
T_D11_P: P11.12 R104.12
T_D12_N: P12.1 R102.6
T_D12_P: P12.2 R102.5
T_D13_N: P12.4 R102.13
T_D13_P: P12.3 R102.12
T_D14_N: P12.5 R102.8
T_D14_P: P12.6 R102.7
T_D15_N: P12.8 R102.11
T_D15_P: P12.7 R102.10
T_D16_N: P12.9 R101.2
T_D16_P: P12.10 R101.1
T_D17_N: P12.12 R101.15
T_D17_P: P12.11 R101.14
T_DEM_N: P12.35 R100.6
T_DEM_P: P12.36 R100.7
T_DPA_N: P12.13 R101.4
T_DPA_P: P12.14 R101.3
T_DS00_N: P12.28 R100.14
T_DS00_P: P12.27 R100.15
T_DS01_N: P12.31 R100.13
T_DS01_P: P12.32 R100.12
T_DS02_N: P12.33 R100.11
T_DS02_P: P12.34 R100.10
T_EBL_N: P11.29 R103.11
T_EBL_P: P11.30 R103.10
T_EXC_N: P11.25 R103.13
T_EXC_P: P11.26 R103.12
T_INIT_N: P11.36 R102.14
T_INIT_P: P11.35 R102.15
T_OCC_N: P12.25 R100.2
T_OCC_P: P12.26 R100.3
T_RS00_N: P11.28 R103.6
T_RS00_P: P11.27 R103.5
T_RS01_N: P11.31 R103.7
T_RS01_P: P11.32 R103.8
T_RS02_N: P11.33 R102.1
T_RS02_P: P11.34 R102.2
T_RS03_N: P10.28 R106.7
T_RS03_P: P10.27 R106.8
T_RS04_N: P10.31 R105.15
T_RS04_P: P10.32 R105.14
T_RUN_N: P10.37 R105.5
T_RUN_P: P10.38 R105.6
T_SCLK_N: P10.25 R106.11
T_SCLK_P: P10.26 R106.10
T_SP1_N: P11.37 R102.3
T_SP1_P: P11.38 R102.4
T_SP2_N: P12.37 R100.8
T_SP2_P: P12.38 R100.9
T_TRA_N: P12.30 R100.5
T_TRA_P: P12.29 R100.4
T_WCLK_N: P10.35 R105.13
T_WCLK_P: P10.36 R105.12
TP59: P10.39 TP108.TP(PP)
TP60: P11.39 TP107.TP(PP)
TP61: P12.39 TP106.TP(PP)

### Notes on the sheet
- BYPASSING
- MASSBUS
  TERMINATION
- SPARES
- MISCELLANEOUS
- 000-0005 | 4

## Library data of the parts
C1-C6 = rcl:CPOL-US: POLARIZED CAPACITOR, American symbol; VOLTAGE: 20V
C100-C129 = rcl:C-EU: CAPACITOR, European symbol
D100-D102 = diode:DIODE_2CACA-: 2 Diodes - Cathode-Anode|Cathode-Anode
D103 = diode:ZENER-DIODE: Z-Diode
J1 = vulcan_custom:JACK-PLUG: DC POWER JACK Power Jack, DC, Right Angle, Through Hole, 2.5mm center pin diameter
LED1-LED4 = led:LED: LED OSRAM: - CHIPLED LG R971, LG N971, LY N971, LG Q971, LY Q971, LO R971, LY R971 LH N974, LH R974 LS Q976, LO Q976, LY Q976 LO Q996 - Hyper CHIPLED LW Q18S LB Q993, LB Q99A, LB R99A - SideLED LS A670, LO A670, LY A670, LG A670, LP A670 LB A673, LV A673, LT A673, LW A673 LH A674 LY A675 LS A676, LA A676, LO A676, LY A676, LW A676 LS A679, LY A679, LG A679 - Hyper Micro SIDELED® LS Y876, LA Y876, LO Y876, LY Y876 LT Y87S - SmartLED LW L88C, LW L88S LB L89C, LB L89S, LG L890 LS L89K, LO L89K, LY L89K LS L896, LA L896, LO L896, LY L896 - TOPLED LS T670, LO T670, LY T670, LG T670, LP T670 LSG T670, LSP T670, LSY T670, LOP T670, LYG T670 LG T671, LOG T671, LSG T671 LB T673, LV T673, LT T673, LW T673 LH T674 LS T676, LA T676, LO T676, LY T676, LB T676, LH T676, LSB T676, LW T676 LB T67C, LV T67C, LT T67C, LS T67K, LO T67K, LY T67K, LW E67C LS E67B, LA E67B, LO E67B, LY E67B, LB E67C, LV E67C, LT E67C LW T67C LS T679, LY T679, LG T679 LS T770, LO T770, LY T770, LG T770, LP T770 LB T773, LV T773, LT T773, LW T773 LH T774 LS E675, LA E675, LY E675, LS T675 LS T776, LA T776, LO T776, LY T776, LB T776 LHGB T686 LT T68C, LB T68C - Hyper Mini TOPLED® LB M676 - Mini TOPLED Santana® LG M470 LS M47K, LO M47K, LY M47K Source: http://www.osram.convergy.de LUXEON: - LUMILED® LXK2-PW12-R00, LXK2-PW12-S00, LXK2-PW14-U00, LXK2-PW14-V00 LXK2-PM12-R00, LXK2-PM12-S00, LXK2-PM14-U00 LXK2-PE12-Q00, LXK2-PE12-R00, LXK2-PE12-S00, LXK2-PE14-T00, LXK2-PE14-U00 LXK2-PB12-K00, LXK2-PB12-L00, LXK2-PB12-M00, LXK2-PB14-N00, LXK2-PB14-P00, LXK2-PB14-Q00 LXK2-PR12-L00, LXK2-PR12-M00, LXK2-PR14-Q00, LXK2-PR14-R00 LXK2-PD12-Q00, LXK2-PD12-R00, LXK2-PD12-S00 LXK2-PH12-R00, LXK2-PH12-S00 LXK2-PL12-P00, LXK2-PL12-Q00, LXK2-PL12-R00 Source: www.luxeon.com KINGBRIGHT: KA-3528ASYC Source: www.kingbright.com
P1-P3 = vulcan_custom:CON50L: CONNECTOR
P4-P12 = vulcan_custom:CON40L: CONNECTOR
Q1 Q2 = vulcan_custom:IRF7104PBF: Dual PFET
R1-R4 R108-R123 = rcl:R-US_: RESISTOR, American symbol
R100-R107 = resistor-bourns:4816P-T02: BOURNS RESISTOR NETWORK; MF: BOURNS, INC.; MPN: 4816P-T02-824LF; OC_FARNELL: 9357599; OC_NEWARK: 33K0777
TP100-TP190 = testpad:TPS: TEST PIN
U1-U20 U22-U30 = vulcan_custom:SN751177NSR: EIA-485-A Compliant Dual Differential Drivers and Receivers
U21 = vulcan_custom:SN74LVC1G27DBV